# Altium schematic sheet MPU6050.SchDoc
size A4
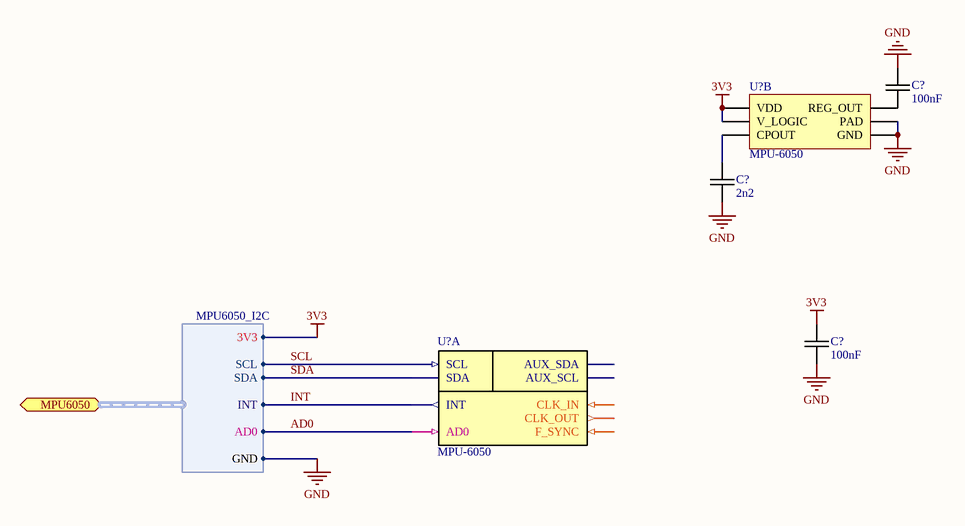
[diagram p0: MPU6050.SchDoc]

## Parts
(Parts that share a designator on the sheet are numbered #1, #2 ... from top to bottom, then left to right.)
C?#1  100nF  [0603C-GENERIC]
C?#2  2n2  [0603C-GENERIC]
C?#3  100nF  [0603C-GENERIC]
U?#1  MPU-6050  [QFN24]  (part B of 2)
U?#2  MPU-6050  [QFN24]  (part A of 2)

## Ports
MPU6050 (harness MPU6050_I2C)

## Harnesses
MPU6050_I2C: SDA, SCL, INT, AD0, 3V3, GND

## Nets
3V3: C?#3.2 U?#1.8(V_LOGIC) U?#1.13(VDD) ; port MPU6050.3V3
GND: C?#1.1 C?#2.1 C?#3.1 U?#1.18(GND) U?#1.25(PAD) ; port MPU6050.GND
AD0: U?#2.9(AD0) ; port MPU6050.AD0
INT: U?#2.12(INT) ; port MPU6050.INT
SCL: U?#2.23(SCL) ; port MPU6050.SCL
SDA: U?#2.24(SDA) ; port MPU6050.SDA
NetC?#1_2: C?#1.2 U?#1.10(REG_OUT)
NetC?#2_2: C?#2.2 U?#1.20(CPOUT)

Not connected (* = marked no-connect by the designer): U?#2 1(CLK_IN) 6(AUX_SDA) 7(AUX_SCL) 11(F_SYNC) 22(CLK_OUT)

## Library data of the parts
C?#1 C?#3 = 0603C-100NF-50V-X7R-TDK: CAPACITOR 0603 CERAMIC; Manufacturer Part Number: C1608X7R1H103K; Manufacturer: TDK Corporation; Temperature Coefficient: X7R; Tolerance: ±10%; Voltage - Rated: 50V; Capacitance: 10000pF; Reel: C68; RoHS: RoHS Compliant; Lead Spacing: -; Package / Case: 0603 (1608 metric); Features: General Purpose; Packaging: Tape & Reel (TR); Thickness: 0.80mm; Operating Temperature: -55°C ~ 125°C; Mounting Type: Surface Mount, MLCC; Category: Capacitors; Supplier 1: Digi-Key; Supplier Part Number 1: 445-1314-2-ND
C?#2 = 0603C-2N2-50V-C0G-MUR: CAPACITOR 0603 CERAMIC; Reel: C4
U?#1 U?#2 = MPU-6050: Integrated 6-axis 3D accelerometer I2c interface